# Altium project Prj_Arduino_Nano.PrjPcb
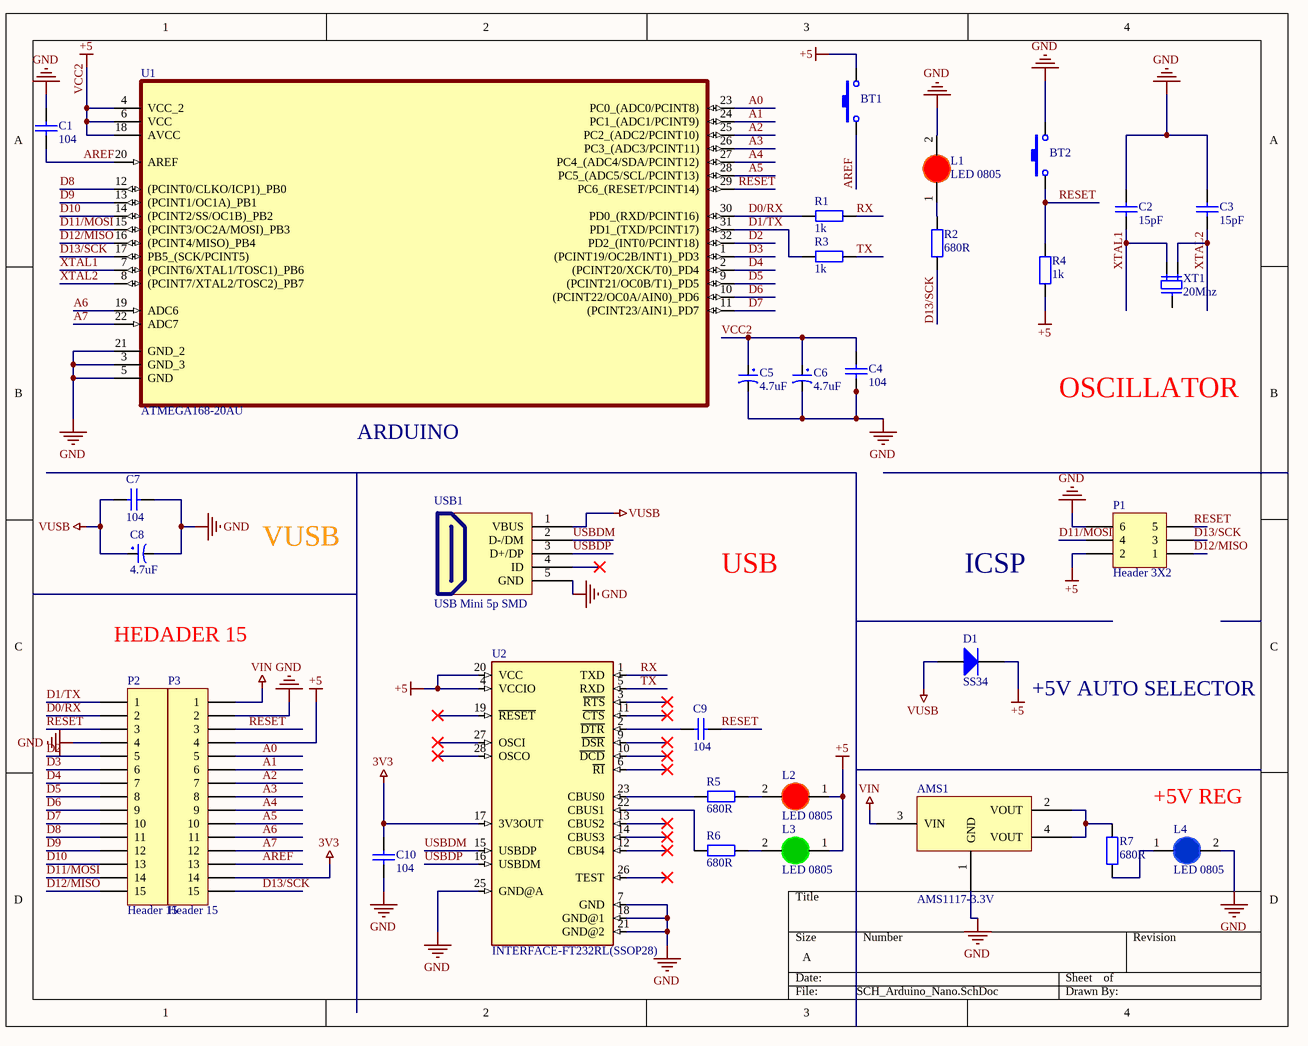
[diagram p0: SCH_Arduino_Nano.SchDoc]
1 sheet, 32 parts. Net scope: global (net labels, ports and power ports of the same name join across sheets).
Board file: PCB_Arduino_Nano.PcbDoc

## Sheet SCH_Arduino_Nano.SchDoc
size A; SheetNumber: 1; SheetTotal: 1

### Parts
AMS1  AMS1117-3.3V  [SOT223]
BT1  Nut Nhan 2 Chan SMD 3x6x2.5  [Nut Nhan 2 Chan SMD 3x6x2.5]  (value not drawn)
BT2  Nut Nhan 2 Chan SMD 3x6x2.5  [Nut Nhan 2 Chan SMD 3x6x2.5]  (value not drawn)
C1  104  [tu 0603]
C2  15pF  [tu 0805]
C3  15pF  [tu 0805]
C4  104  [tu 0603]
C5  4.7uF  [tu tantalum smd6032]
C6  4.7uF  [tu tantalum smd6032]
C7  104  [tu 0603]
C8  4.7uF  [tu tantalum smd6032]
C9  104  [tu 0603]
C10  104  [tu 0603]
D1  SS34  [DIODE SMA]
L1  LED 0805  [LED-0805-Red]
L2  LED 0805  [LED-0805-Red]
L3  LED 0805  [LED-0805-Green]
L4  LED 0805  [LED-0805-Blue]
P1  Header 3X2  [HDR2X3]
P2  Header 15  [HDR1X15]
P3  Header 15  [HDR1X15]
R1  1k  [tro smd 0603]
R2  680R  [Tro SMD 0805]
R3  1k  [tro smd 0603]
R4  1k  [tro smd 0805]
R5  680R  [tro smd 0603]
R6  680R  [tro smd 0603]
R7  680R  [tro smd 0603]
U1  ATMEGA168-20AU  [QFP80P900X900X120-32N]
U2  INTERFACE-FT232RL(SSOP28)  [SSOP28-0.65-10.2X5.2MM]
USB1  USB Mini 5p SMD  [USB Mini 5p SMD]
XT1  20Mhz  [Thach Anh 3 Chan SMD]

### Nets
3V3: C10.1 P3.14 U2.17(3V3OUT)
GND: AMS1.1(GND) BT2.1 C1.2 C2.2 C3.2 C4.2 C5.2 C6.2 C7.1 C8.2 C10.2 L1.2(K) L4.2(K) P1.6 P2.4 P3.2 U1.3(GND_3) U1.5(GND) U1.21(GND_2) U2.7(GND) U2.18(GND@1) U2.21(GND@2) U2.25(GND@A) USB1.5(GND)
VCC2: BT1.2 C4.1 C5.1 C6.1 D1.2(K) L2.1(A) L3.1(A) P1.2 P3.4 R4.1 U1.4(VCC_2) U1.6(VCC) U1.18(AVCC) U2.4(VCCIO) U2.20(VCC)  [also labelled +5]
VIN: AMS1.3(VIN) P3.1
VUSB: C7.2 C8.1 D1.1(A) USB1.1(VBUS)
A0: P3.5 U1.23(PC0_(ADC0/PCINT8))
A1: P3.6 U1.24(PC1_(ADC1/PCINT9))
A2: P3.7 U1.25(PC2_(ADC2/PCINT10))
A3: P3.8 U1.26(PC3_(ADC3/PCINT11))
A4: P3.9 U1.27(PC4_(ADC4/SDA/PCINT12))
A5: P3.10 U1.28(PC5_(ADC5/SCL/PCINT13))
A6: P3.11 U1.19(ADC6)
A7: P3.12 U1.22(ADC7)
AREF: BT1.1 C1.1 P3.13 U1.20(AREF)
D0/RX: P2.2 R1.1 U1.30(PD0_(RXD/PCINT16))
D1/TX: P2.1 R3.1 U1.31(PD1_(TXD/PCINT17))
D2: P2.5 U1.32(PD2_(INT0/PCINT18))
D3: P2.6 U1.1((PCINT19/OC2B/INT1)_PD3)
D4: P2.7 U1.2((PCINT20/XCK/T0)_PD4)
D5: P2.8 U1.9((PCINT21/OC0B/T1)_PD5)
D6: P2.9 U1.10((PCINT22/OC0A/AIN0)_PD6)
D7: P2.10 U1.11((PCINT23/AIN1)_PD7)
D8: P2.11 U1.12((PCINT0/CLKO/ICP1)_PB0)
D9: P2.12 U1.13((PCINT1/OC1A)_PB1)
D10: P2.13 U1.14((PCINT2/SS/OC1B)_PB2)
D11/MOSI: P1.4 P2.14 U1.15((PCINT3/OC2A/MOSI)_PB3)
D12/MISO: P1.1 P2.15 U1.16((PCINT4/MISO)_PB4)
D13/SCK: P1.3 P3.15 R2.2 U1.17(PB5_(SCK/PCINT5))
RESET: BT2.2 C9.1 P1.5 P2.3 P3.3 R4.2 U1.29(PC6_(RESET/PCINT14))
RX: R1.2 U2.1(TXD)
TX: R3.2 U2.5(RXD)
USBDM: U2.15(USBDP) USB1.2(D-/DM)
USBDP: U2.16(USBDM) USB1.3(D+/DP)
XTAL1: C2.1 U1.7((PCINT6/XTAL1/TOSC1)_PB6) XT1.1
XTAL2: C3.1 U1.8((PCINT7/XTAL2/TOSC2)_PB7) XT1.3
NetAMS1_2: AMS1.2(VOUT) AMS1.4(VOUT) R7.2
NetC9_2: C9.2 U2.2(~{DTR})
NetL1_1: L1.1(A) R2.1
NetL2_2: L2.2(K) R5.2
NetL3_2: L3.2(K) R6.2
NetL4_1: L4.1(A) R7.1
NetR5_1: R5.1 U2.23(CBUS0)
NetR6_1: R6.1 U2.22(CBUS1)

Not connected (* = marked no-connect by the designer): U2 3(~{RTS})* 6(~{RI})* 9(~{DSR})* 10(~{DCD})* 11(~{CTS})* 12(CBUS4)* 13(CBUS2)* 14(CBUS3)* 19(~{RESET})* 26(TEST)* 27(OSCI)* 28(OSCO)*; USB1 4(ID)*; XT1 2

### Notes on the sheet
- (near U1) ARDUINO
- OSCILLATOR
- VUSB
- USB
- ICSP
- HEDADER 15
- +5V AUTO SELECTOR
- +5V REG

### Library data of the parts
AMS1 = AMS1117 SMD: Dán; Value: AMS1117-3.3V SOT223; Don_Vi: Con; Ma_Hang: MH000596; Ghi_Chu: *; Kieu_Chan: *; Chung_Loai: Dán
BT1 BT2 = Nut Nhan 2 Chan SMD 3x6x2.5: Ma_Hang: MH001036; Ten: Nút Nhấn 2 Chân 3x6x2.5MM SMD
C1 C4 C7 C9 C10 = Tu 0603 104 50V 10%: Dán; Don_Vi: Con; So_Chan: 2; Ten_Linh_Kien: Tụ 0603 104-100nF 10% 50V; Ma_Hang: MH004568; Chung_Loai: Dán; Kieu_Chan: *
C2 C3 = Tu 0805 15pF 50V 10%: Dán; Don_Vi: Con; So_Chan: 2; Ten_Linh_Kien: Tụ 0805 15P 10% 50V; Ma_Hang: MH004556; Chung_Loai: Dán; Kieu_Chan: *
C5 C6 C8 = Tu tantalum 4.7uF 35V SMD6032: Dán; Don_Vi: Con; So_Chan: 2; Ten_Linh_Kien: Tụ tantalum 475V-4.7uF 35V SMD6032; Ma_Hang: MH008687; Chung_Loai: Dán; Kieu_Chan: *
D1 = Diode SS34 ( 1N5822 ): Dán; Don_Vi: Con; Ma_Hang: MH002104; Ten_Linh_Kien: Diode SS34 3A 40V SMA ( 1N5822 SS34A); Kieu_Chan: *; Chung_Loai: Dán
L1 L2 = LED 0805 Do: Dán; Don_Vi: Con; Ma_Hang: MH000897; Ten_Linh_Kien: LED 0805 Màu Đỏ (Red); Ghi_Chu: *; Kieu_Chan: *; Chung_Loai: Dán
L3 = LED 0805 Xanh La: Dán; Don_Vi: Con; Ma_Hang: MH002326; Ten_Linh_Kien: LED 0805 Màu Xanh Lá (Green); Ghi_Chu: *; Kieu_Chan: *; Chung_Loai: Dán
L4 = LED 0805 Xanh Duong: Dán; Don_Vi: Con; Ma_Hang: MH002327; Ten_Linh_Kien: LED 0805 Màu Xanh Dương (Blue); Ghi_Chu: *; Kieu_Chan: *; Chung_Loai: Dán
P1 = Header 3X2: Header, 3-Pin, Dual row; LatestRevisionDate: 17-Jul-2002; LatestRevisionNote: Re-released for DXP Platform.; Publisher: Altium Limited
P2 P3 = Header 15: Header, 15-Pin; LatestRevisionDate: 17-Jul-2002; LatestRevisionNote: Re-released for DXP Platform.; Publisher: Altium Limited
R1 R3 = Tro 0603 5% 1k: Dán; Don_Vi: Con; So_Chan: 2; Ten_Linh_Kien: Trở 0603 5% 1k; Ma_Hang: MH006319; Chung_Loai: Dán; Kieu_Chan: *
R2 = Tro 0805 5% 680R: Dán; Don_Vi: Con; Ma_Hang: MH005344; So_Chan: 2; Ten_Linh_Kien: Trở 0805 5% 680R; Chung_Loai: Dán; Kieu_Chan: *
R4 = Tro 0805 5% 1k: Dán; Don_Vi: Con; So_Chan: 2; Ten_Linh_Kien: Trở 0805 5% 1k; Ma_Hang: MH005234; Chung_Loai: Dán; Kieu_Chan: *
R5-R7 = Tro 0603 1% 680R: Dán; Don_Vi: Con; So_Chan: 2; Ten_Linh_Kien: Trở 0603 1% 680R; Ma_Hang: MH006336; Chung_Loai: Dán; Kieu_Chan: *
U1 = ATMEGA168-20AU: AVR AVRÂ® ATmega Microcontroller IC 8-Bit 20MHz 16KB _8K x 16_ FLASH 32-TQFP _7x7_; MF: Microchip; MP: ATMEGA168-20AU; Availability: Unavailable; Package: TQFP-32 Microchip; Price: None; SnapEDA_Link: https://www.snapeda.com/parts/ATMEGA168-20AU/Microchip/view-part/776709/?ref=snap; Value: *
U2 = INTERFACE-FT232RL(SSOP28): USB Bridge, USB to UART USB 2.0 UART Interface 28-SSOP; MF: FTDI, Future; SnapEDA_Link: https://www.snapeda.com/parts/FT232RL/FTDI%2C%20Future%20Technology%20Devices%20International%20Ltd/view-part/1077088/?ref=snap; Package: SSOP-28 FTDI, Future; MP: FT232RL; Price: None; Value: *; Availability: Unavailable
USB1 = USB Mini 5p SMD: USB Type B; Ten: MiniUSB 5P SMD; Ma_Hang: MH001022
XT1 = Thach anh 3 Chan SMD: Crystal For all Crystal 2pin.; Value: 4Mhz